# Altium schematic sheet EVENTCTRL_DDS.SchDoc: DDS
size A4; Author: ZLY; DocumentNumber: 9321-E-1102-EMRT EVENT CONTROLLER ACQ; Revision: 1.0; SheetNumber: 4; SheetTotal: 6
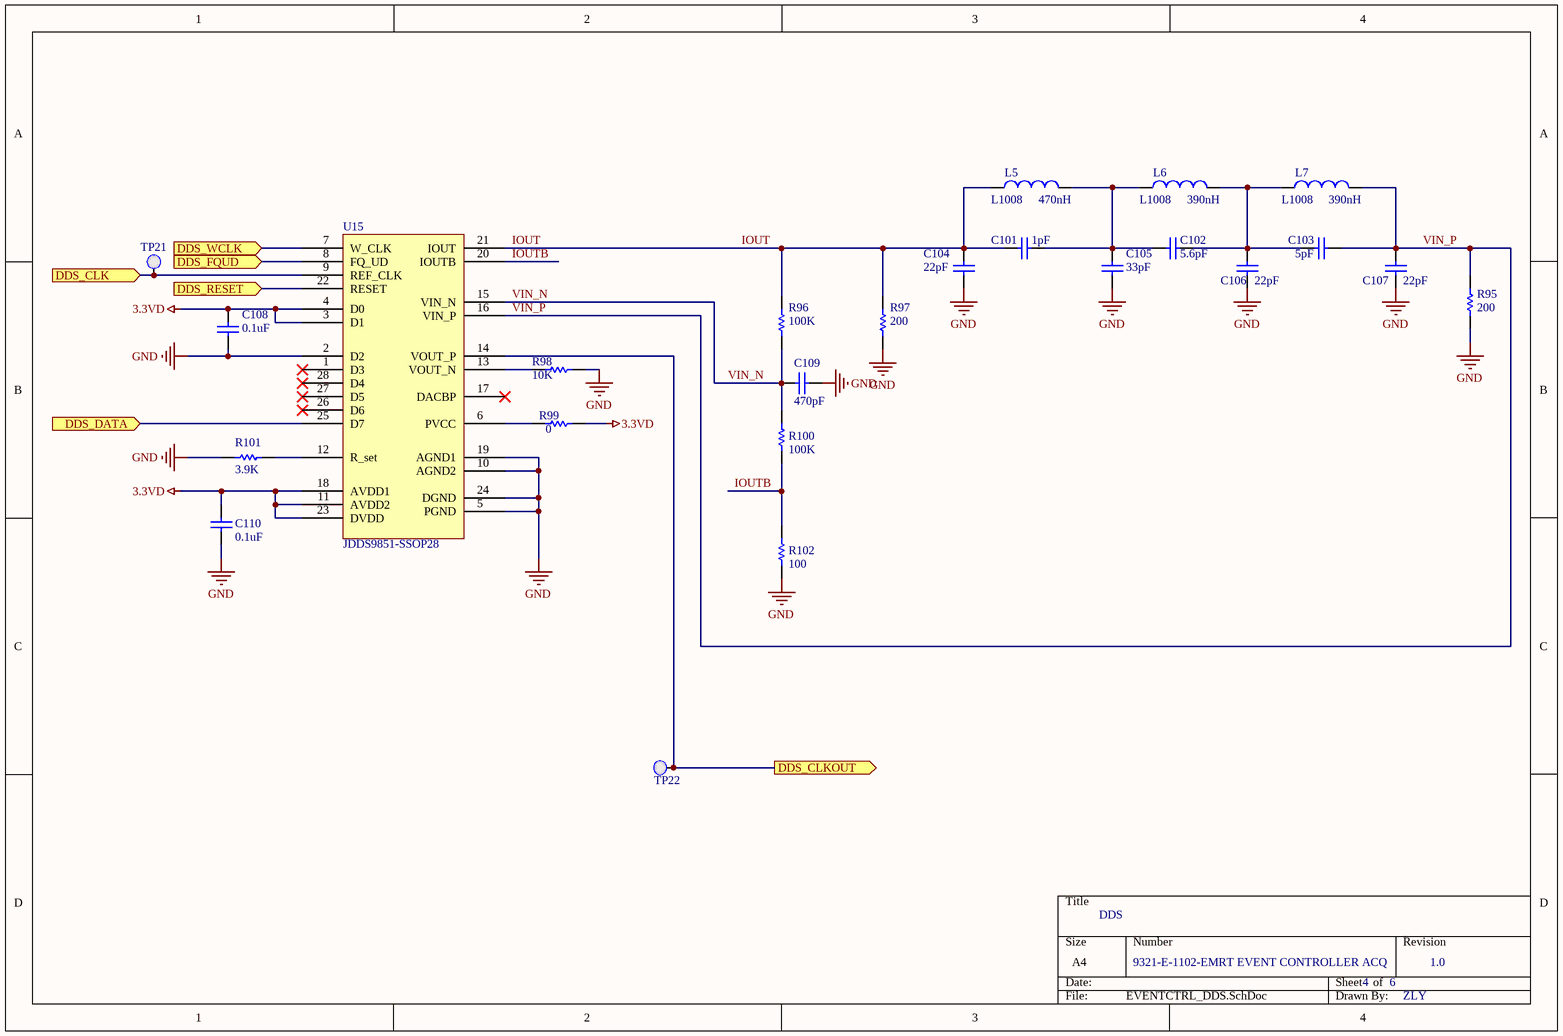
[diagram p0: EVENTCTRL_DDS.SchDoc]

## Parts
C101  value 1pF  [0805]  (hidden comment: C0805)
C102  value 5.6pF  [0805]  (hidden comment: C0805)
C103  value 5pF  [0805]  (hidden comment: C0805)
C104  value 22pF  [0805]  (hidden comment: C0805)
C105  value 33pF  [0805]  (hidden comment: C0805)
C106  value 22pF  [0805]  (hidden comment: C0805)
C107  value 22pF  [0805]  (hidden comment: C0805)
C108  value 0.1uF  [0805]  (hidden comment: C0805)
C109  value 470pF  [0805]  (hidden comment: C0805)
C110  value 0.1uF  [0805]  (hidden comment: C0805)
L5  L1008  value 470nH  [1008]
L6  L1008  value 390nH  [1008]
L7  L1008  value 390nH  [1008]
R95  value 200  [R0805]  (hidden comment: R0805)
R96  value 100K  [R0805]  (hidden comment: R0805)
R97  value 200  [R0805]  (hidden comment: R0805)
R98  value 10K  [R0805]  (hidden comment: R0805)
R99  value 0  [R0805]  (hidden comment: R0805)
R100  value 100K  [R0805]  (hidden comment: R0805)
R101  value 3.9K  [R0805]  (hidden comment: R0805)
R102  value 100  [R0805]  (hidden comment: R0805)
TP21  TP  [TPA]  (value not drawn)
TP22  TP  [TPA]  (value not drawn)
U15  JDDS9851-SSOP28  [TSSOP28]

## Ports
DDS_CLK (in), DDS_CLKOUT (out), DDS_DATA (in), DDS_FQUD (in), DDS_RESET (in), DDS_WCLK (in)

## Nets
3.3VD: C108.2 C110.2 R99.2 U15.3(D1) U15.4(D0) U15.11(AVDD2) U15.18(AVDD1) U15.23(DVDD)
GND: C104.1 C105.1 C106.1 C107.1 C108.1 C109.1 C110.1 R95.1 R97.1 R98.2 R101.1 R102.1 U15.2(D2) U15.5(PGND) U15.10(AGND2) U15.19(AGND1) U15.24(DGND)
DDS_CLK: TP21.1(TP) U15.9(REF_CLK) ; port DDS_CLK
DDS_CLKOUT: TP22.1(TP) U15.14(VOUT_P) ; port DDS_CLKOUT
DDS_DATA: U15.25(D7) ; port DDS_DATA
DDS_FQUD: U15.8(FQ_UD) ; port DDS_FQUD
DDS_RESET: U15.22(RESET) ; port DDS_RESET
DDS_WCLK: U15.7(W_CLK) ; port DDS_WCLK
IOUT: C101.1 C104.2 L5.1 R96.2 R97.2 U15.21(IOUT)
IOUTB: R100.1 R102.2 U15.20(IOUTB)
VIN_N: C109.2 R96.1 R100.2 U15.15(VIN_N)
VIN_P: C103.2 C107.2 L7.2 R95.2 U15.16(VIN_P)
NetC101_2: C101.2 C102.1 C105.2 L5.2 L6.1
NetC102_2: C102.2 C103.1 C106.2 L6.2 L7.1
NetR98_1: R98.1 U15.13(VOUT_N)
NetR99_1: R99.1 U15.6(PVCC)
NetR101_2: R101.2 U15.12(R_set)

Not connected (* = marked no-connect by the designer): U15 1(D3)* 17(DACBP)* 26(D6)* 27(D5)* 28(D4)*

## Library data of the parts
C101-C110 = Cap: Capacitor; PackageReference: C0805
L5-L7 = Inductor
R95-R102 = Res1: Resistor; PackageReference: R0805
U15 = JS9851